# Altium schematic sheet ADC.SchDoc
size A; SheetNumber: 6; SheetTotal: 7
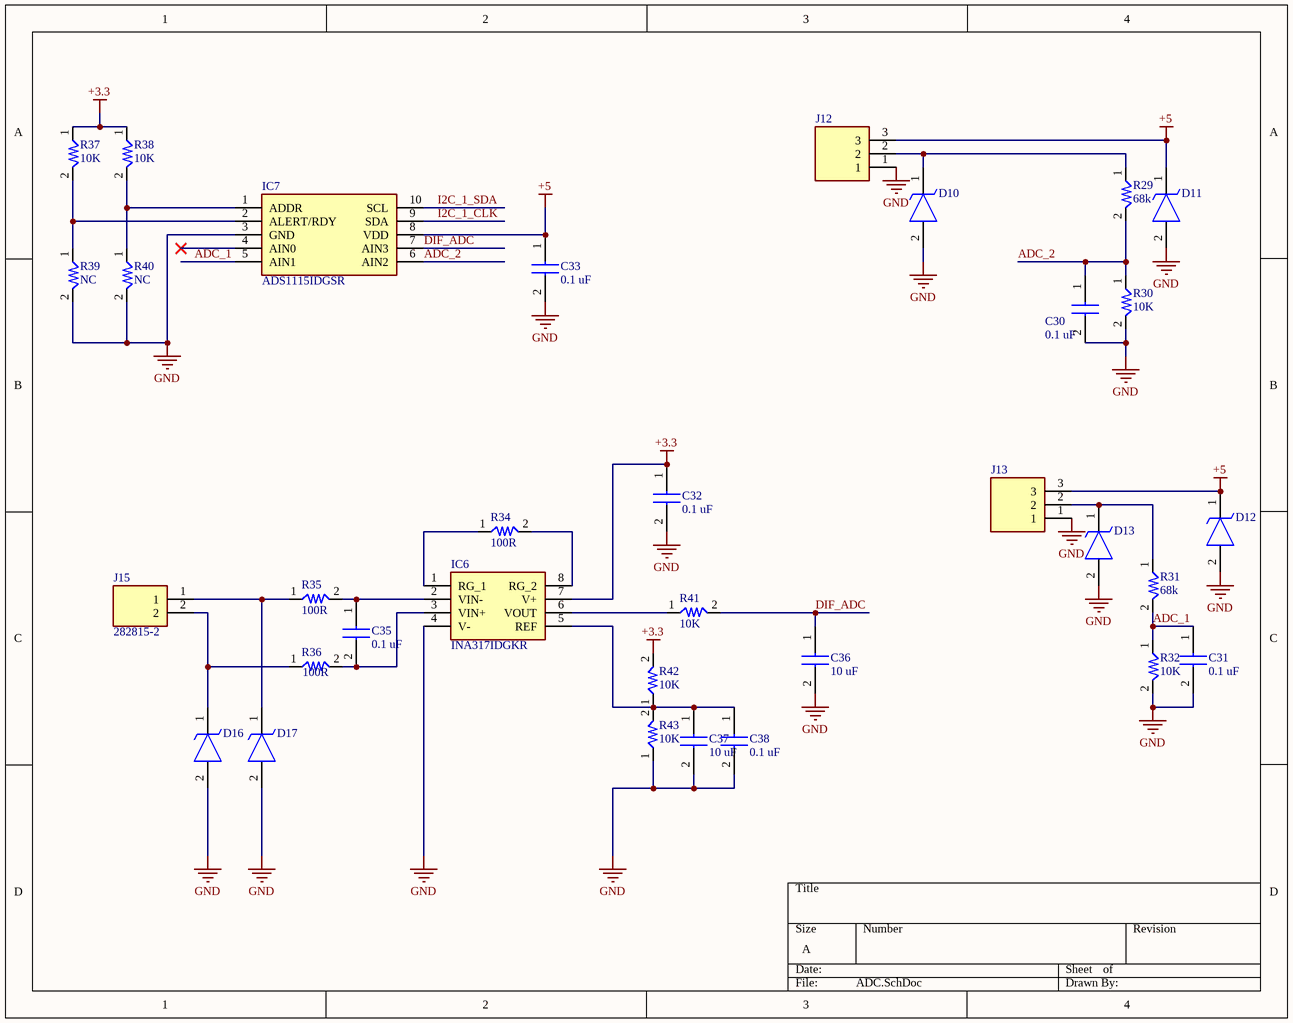
[diagram p0: ADC.SchDoc]

## Parts
C30  0.1 uF  [CAP0603]
C31  0.1 uF  [CAP0603]
C32  0.1 uF  [CAP0603]
C33  0.1 uF  [CAP0603]
C35  0.1 uF  [CAP0603]
C36  10 uF  [CAP0603]
C37  10 uF  [CAP0603]
C38  0.1 uF  [CAP0603]
D10  SMBJ5.0A  [SMBJ12A]  (value not drawn)
D11  SMBJ5.0A  [SMBJ12A]  (value not drawn)
D12  SMBJ5.0A  [SMBJ12A]  (value not drawn)
D13  SMBJ5.0A  [SMBJ12A]  (value not drawn)
D16  SMBJ5.0A  [SMBJ12A]  (value not drawn)
D17  SMBJ5.0A  [SMBJ12A]  (value not drawn)
IC6  INA317IDGKR  [SOP65P490X110-8N]
IC7  ADS1115IDGSR  [SOP50P490X110-10N]
J12  282815-3  [2828153]  (value not drawn)
J13  282815-3  [2828153]  (value not drawn)
J15  282815-2  [SHDRRA2W102P0X508_1X2_1016X1200X850P]
R29  68k  [RES0603]
R30  10K  [RES0603]
R31  68k  [RES0603]
R32  10K  [RES0603]
R34  100R  [RES0603]
R35  100R  [RES0603]
R36  100R  [RES0603]
R37  10K  [RES0603]
R38  10K  [RES0603]
R39  NC  [RES0603]
R40  NC  [RES0603]
R41  10K  [RES0603]
R42  10K  [RES0603]
R43  10K  [RES0603]

## Nets
+3.3: C32.1 IC6.7(V+) R37.1 R38.1 R42.2
+5: C33.1 D11.1(K) D12.1(K) IC7.8(VDD) J12.3 J13.3
GND: C30.2 C31.2 C32.2 C33.2 C36.2 C37.2 C38.2 D10.2(A) D11.2(A) D12.2(A) D13.2(A) D16.2(A) D17.2(A) IC6.4(V-) IC7.3(GND) J12.1 J13.1 R30.2 R32.2 R39.2 R40.2 R43.1
ADC_1: C31.1 IC7.5(AIN1) R31.2 R32.1
ADC_2: C30.1 IC7.6(AIN2) R29.2 R30.1
DIF_ADC: C36.1 IC7.7(AIN3) R41.2
I2C_1_CLK: IC7.9(SDA)
I2C_1_SDA: IC7.10(SCL)
NetC35_1: C35.1 IC6.2(VIN-) R35.2
NetC35_2: C35.2 IC6.3(VIN+) R36.2
NetC37_1: C37.1 C38.1 IC6.5(REF) R42.1 R43.2
NetD10_1: D10.1(K) J12.2 R29.1
NetD13_1: D13.1(K) J13.2 R31.1
NetD16_1: D16.1(K) J15.2 R36.1
NetD17_1: D17.1(K) J15.1 R35.1
NetIC6_1: IC6.1(RG_1) R34.1
NetIC6_6: IC6.6(VOUT) R41.1
NetIC6_8: IC6.8(RG_2) R34.2
NetIC7_1: IC7.1(ADDR) R38.2 R40.1
NetIC7_2: IC7.2(ALERT/RDY) R37.2 R39.1

Not connected (* = marked no-connect by the designer): IC7 4(AIN0)*

## Library data of the parts
C30-C33 C35-C38 = CC0603KRX7R9BB104: Capacitor; Manufacturer_Name: YAGEO; Datasheet Link: https://componentsearchengine.com/Datasheets/2/CC0603KRX7R9BB104.pdf; Height: 0.9mm; Manufacturer_Part_Number: CC0603KRX7R9BB104; Mouser Part Number: 603-CC603KRX7R9BB104; Mouser Price/Stock: https://www.mouser.co.uk/ProductDetail/YAGEO/CC0603KRX7R9BB104?qs=vTakOoo5QyLvVCYM2ge8LQ%3D%3D; Arrow Part Number: CC0603KRX7R9BB104; Arrow Price/Stock: https://www.arrow.com/en/products/cc0603krx7r9bb104/yageo?utm_currency=USD&region=europe
D10-D13 D16 D17 = SMBJ5.0A: TVS Diode (Uni-directional); Manufacturer_Name: STMicroelectronics; Datasheet Link: https://www.st.com/resource/en/datasheet/smbj12a.pdf; Height: 2.45mm; Manufacturer_Part_Number: SMBJ5.0A
IC6 = INA317IDGKR: Integrated Circuit; Manufacturer_Name: Texas Instruments; Datasheet Link: http://www.ti.com/lit/gpn/ina317; Height: 1.1mm; Manufacturer_Part_Number: INA317IDGKR; Mouser Part Number: 595-INA317IDGKR; Mouser Price/Stock: https://www.mouser.co.uk/ProductDetail/Texas-Instruments/INA317IDGKR?qs=W0yvOO0ixfHq371pIwwl1g%3D%3D; Arrow Part Number: INA317IDGKR; Arrow Price/Stock: https://www.arrow.com/en/products/ina317idgkr/texas-instruments?utm_currency=USD&region=nac
IC7 = ADS1115IDGSR: Integrated Circuit; Manufacturer_Name: Texas Instruments; Datasheet Link: http://www.ti.com/lit/gpn/ADS1115; Height: 1.1mm; Manufacturer_Part_Number: ADS1115IDGSR; Mouser Part Number: 595-ADS1115IDGSR; Mouser Price/Stock: https://www.mouser.co.uk/ProductDetail/Texas-Instruments/ADS1115IDGSR?qs=IK5e5L0zOXjKCJoVMhYO%2FQ%3D%3D; Arrow Part Number: ADS1115IDGSR; Arrow Price/Stock: https://www.arrow.com/en/products/ads1115idgsr/texas-instruments.html?utm_currency=USD&region=nac
J12 J13 = 282815-3: Connector; Manufacturer_Name: TE Connectivity; Datasheet Link: https://www.te.com/commerce/DocumentDelivery/DDEController?Action=srchrtrv&DocNm=1-773958-1&DocType=Data%20Sheet&DocLang=English&PartCntxt=282815-3&DocFormat=pdf; Height: 8.35mm; Manufacturer_Part_Number: 282815-3; Mouser Part Number: 571-282815-3; Mouser Price/Stock: https://www.mouser.co.uk/ProductDetail/TE-Connectivity/282815-3?qs=79%2FjLZ2kXkqd6grVMiPYfw%3D%3D; Arrow Part Number: 282815-3; Arrow Price/Stock: https://www.arrow.com/en/products/282815-3/te-connectivity
J15 = 282815-2: Connector; Manufacturer_Name: TE Connectivity; Datasheet Link: https://www.te.com/commerce/DocumentDelivery/DDEController?Action=srchrtrv&DocNm=1-773958-1&DocType=Data%20Sheet&DocLang=English&PartCntxt=282815-2&DocFormat=pdf; Height: 8.5mm; Manufacturer_Part_Number: 282815-2; Mouser Part Number: 571-282815-2; Mouser Price/Stock: https://www.mouser.co.uk/ProductDetail/TE-Connectivity/282815-2?qs=79%2FjLZ2kXkpF7MFURi982A%3D%3D; Arrow Part Number: 282815-2; Arrow Price/Stock: https://www.arrow.com/en/products/282815-2/te-connectivity?region=nac
R29-R32 R34-R43 = RES: Resistor; Manufacturer_Name: UNI-ROYAL(Uniroyal Elec); Manufacturer_Part_Number: 0603WAF1001T5E; Datasheet Link: https://datasheet.lcsc.com/szlcsc/Uniroyal-Elec-0603WAF1001T5E_C21190.pdf; Height: 0.55mm